# Altium schematic sheet Sheet1.SchDoc
size A3
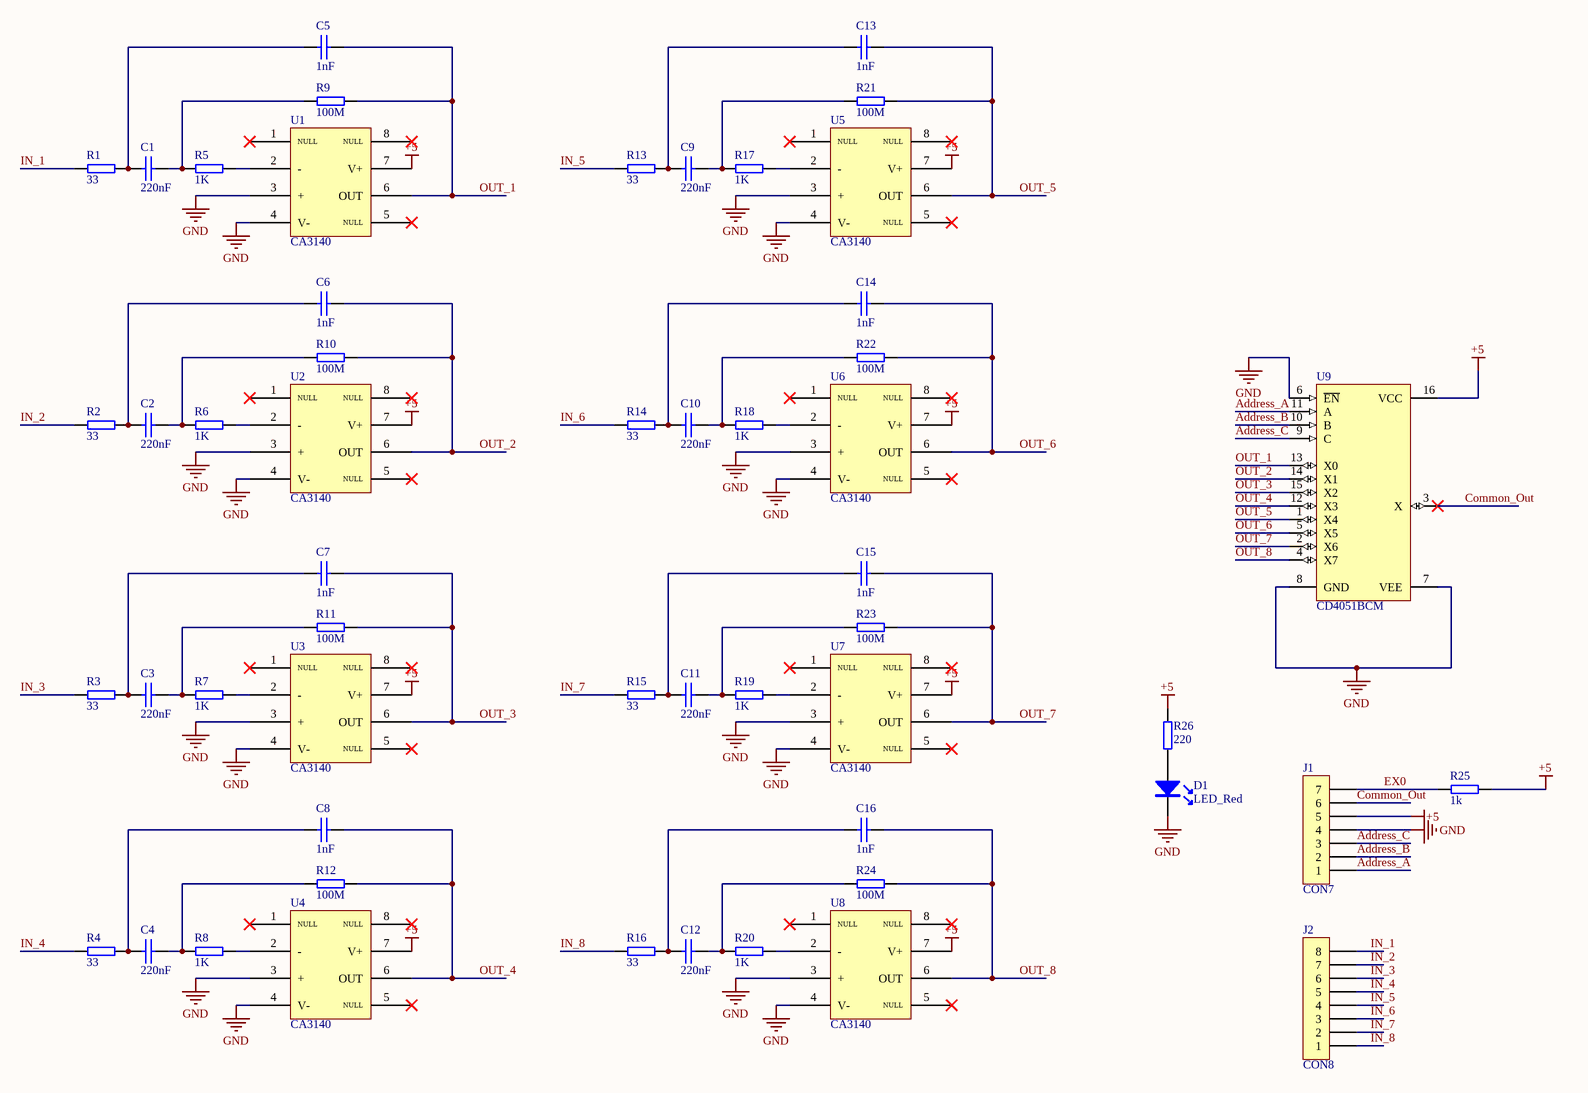
[diagram p0: Sheet1.SchDoc]

## Parts
C1  220nF  [6-0805_L]
C2  220nF  [6-0805_L]
C3  220nF  [6-0805_L]
C4  220nF  [6-0805_L]
C5  1nF  [6-0805_L]
C6  1nF  [6-0805_L]
C7  1nF  [6-0805_L]
C8  1nF  [6-0805_L]
C9  220nF  [6-0805_L]
C10  220nF  [6-0805_L]
C11  220nF  [6-0805_L]
C12  220nF  [6-0805_L]
C13  1nF  [6-0805_L]
C14  1nF  [6-0805_L]
C15  1nF  [6-0805_L]
C16  1nF  [6-0805_L]
D1  LED_Red  [6-0805_M]
J1  CON7  [HDR1X7]
J2  CON8  [XH2.54-8P]
R1  33  [6-0805_M]
R2  33  [6-0805_M]
R3  33  [6-0805_M]
R4  33  [6-0805_M]
R5  1K  [6-0805_M]
R6  1K  [6-0805_M]
R7  1K  [6-0805_M]
R8  1K  [6-0805_M]
R9  100M  [6-0805_M]
R10  100M  [6-0805_M]
R11  100M  [6-0805_M]
R12  100M  [6-0805_M]
R13  33  [6-0805_M]
R14  33  [6-0805_M]
R15  33  [6-0805_M]
R16  33  [6-0805_M]
R17  1K  [6-0805_M]
R18  1K  [6-0805_M]
R19  1K  [6-0805_M]
R20  1K  [6-0805_M]
R21  100M  [6-0805_M]
R22  100M  [6-0805_M]
R23  100M  [6-0805_M]
R24  100M  [6-0805_M]
R25  1k  [6-0805_M]
R26  220  [6-0805_M]
U1  CA3140  [SO8_M]
U2  CA3140  [SO8_M]
U3  CA3140  [SO8_M]
U4  CA3140  [SO8_M]
U5  CA3140  [SO8_M]
U6  CA3140  [SO8_M]
U7  CA3140  [SO8_M]
U8  CA3140  [SO8_M]
U9  CD4051BCM  [M16A_N]

## Nets
+5: J1.5 R25.2 R26.2 U1.7(V+) U2.7(V+) U3.7(V+) U4.7(V+) U5.7(V+) U6.7(V+) U7.7(V+) U8.7(V+) U9.16(VCC)
GND: D1.2 J1.4 U1.3(+) U1.4(V-) U2.3(+) U2.4(V-) U3.3(+) U3.4(V-) U4.3(+) U4.4(V-) U5.3(+) U5.4(V-) U6.3(+) U6.4(V-) U7.3(+) U7.4(V-) U8.3(+) U8.4(V-) U9.6(~{EN}) U9.7(VEE) U9.8(GND)
Address_A: J1.1 U9.11(A)
Address_B: J1.2 U9.10(B)
Address_C: J1.3 U9.9(C)
Common_Out: J1.6 U9.3(X)
EX0: J1.7 R25.1
IN_1: J2.8 R1.1
IN_2: J2.7 R2.1
IN_3: J2.6 R3.1
IN_4: J2.5 R4.1
IN_5: J2.4 R13.1
IN_6: J2.3 R14.1
IN_7: J2.2 R15.1
IN_8: J2.1 R16.1
OUT_1: C5.2 R9.2 U1.6(OUT) U9.13(X0)
OUT_2: C6.2 R10.2 U2.6(OUT) U9.14(X1)
OUT_3: C7.2 R11.2 U3.6(OUT) U9.15(X2)
OUT_4: C8.2 R12.2 U4.6(OUT) U9.12(X3)
OUT_5: C13.2 R21.2 U5.6(OUT) U9.1(X4)
OUT_6: C14.2 R22.2 U6.6(OUT) U9.5(X5)
OUT_7: C15.2 R23.2 U7.6(OUT) U9.2(X6)
OUT_8: C16.2 R24.2 U8.6(OUT) U9.4(X7)
NetC1_1: C1.1 C5.1 R1.2
NetC1_2: C1.2 R5.1 R9.1
NetC2_1: C2.1 C6.1 R2.2
NetC2_2: C2.2 R6.1 R10.1
NetC3_1: C3.1 C7.1 R3.2
NetC3_2: C3.2 R7.1 R11.1
NetC4_1: C4.1 C8.1 R4.2
NetC4_2: C4.2 R8.1 R12.1
NetC9_1: C9.1 C13.1 R13.2
NetC9_2: C9.2 R17.1 R21.1
NetC10_1: C10.1 C14.1 R14.2
NetC10_2: C10.2 R18.1 R22.1
NetC11_1: C11.1 C15.1 R15.2
NetC11_2: C11.2 R19.1 R23.1
NetC12_1: C12.1 C16.1 R16.2
NetC12_2: C12.2 R20.1 R24.1
NetD1_1: D1.1 R26.1
NetR5_2: R5.2 U1.2(-)
NetR6_2: R6.2 U2.2(-)
NetR7_2: R7.2 U3.2(-)
NetR8_2: R8.2 U4.2(-)
NetR17_2: R17.2 U5.2(-)
NetR18_2: R18.2 U6.2(-)
NetR19_2: R19.2 U7.2(-)
NetR20_2: R20.2 U8.2(-)

Not connected (* = marked no-connect by the designer): U1 1(NULL)* 5(NULL)* 8(NULL)*; U2 1(NULL)* 5(NULL)* 8(NULL)*; U3 1(NULL)* 5(NULL)* 8(NULL)*; U4 1(NULL)* 5(NULL)* 8(NULL)*; U5 1(NULL)* 5(NULL)* 8(NULL)*; U6 1(NULL)* 5(NULL)* 8(NULL)*; U7 1(NULL)* 5(NULL)* 8(NULL)*; U8 1(NULL)* 5(NULL)* 8(NULL)*

## Library data of the parts
C1-C16 = CAP: 电容
D1 = LED
J1 = CON7: Connector
J2 = CON8: 连接器
R1-R26 = RES: 电阻
U9 = CD4051BCM: 8-Channel Analog Multiplexer/Demultiplexer; Published: 17-Jul-2002; LatestRevisionDate: 13-Apr-2006; LatestRevisionNote: IPC-7351 Footprint Added.; DatasheetVersion: Jan-1999; PackageVersion: 2000; PackageReference: M16A; Publisher: Altium Limited; PackageDescription: 16-Pin Small Outline Integrated Circuit 1.27 mm Pitch; Code_IPC: SOIC127P600-16; ComponentLink1Description: Manufacturer Link; ComponentLink1URL: http://www.fairchildsemi.com/; ComponentLink2Description: Datasheet; ComponentLink2URL: http://www.fairchildsemi.com/ds/CD%2FCD4052BC.pdf